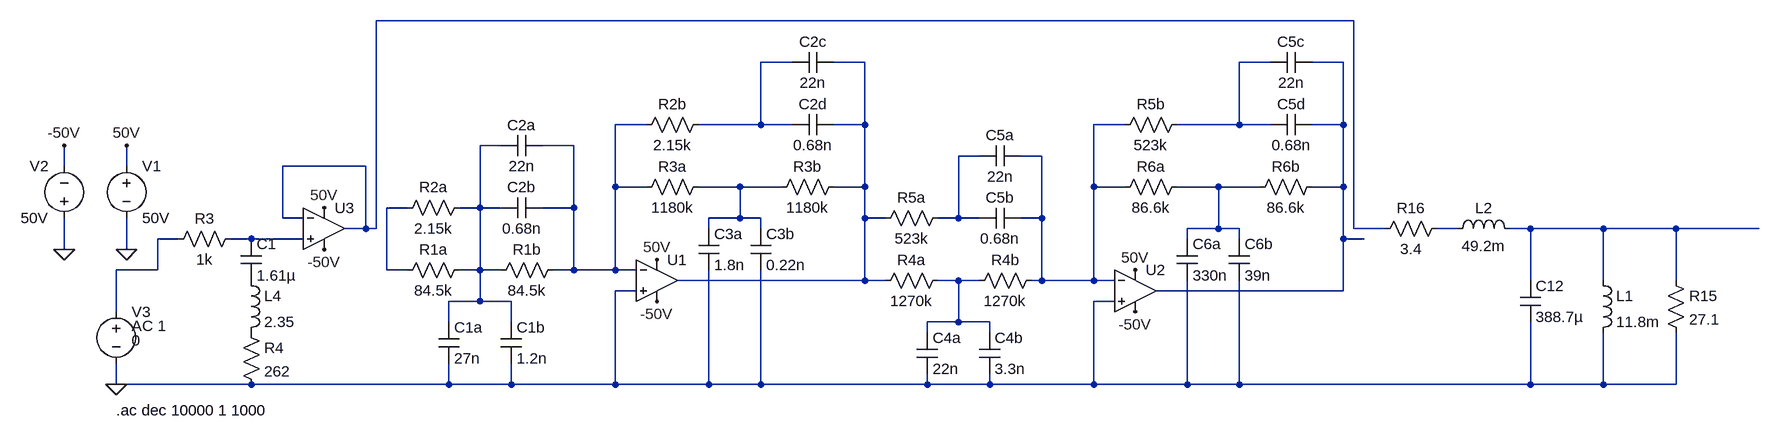
[diagram p0: schematic EXPERIMENT.asc]
EXPERIMENT.asc, the LTspice schematic file:
Version 4
SHEET 1 1284 1184
WIRE 480 160 -1024 160
WIRE -384 224 -432 224
WIRE -272 224 -320 224
WIRE 352 224 304 224
WIRE 464 224 416 224
WIRE -608 320 -656 320
WIRE -432 320 -432 224
WIRE -432 320 -528 320
WIRE -384 320 -432 320
WIRE -272 320 -272 224
WIRE -272 320 -320 320
WIRE 128 320 80 320
WIRE 304 320 304 224
WIRE 304 320 208 320
WIRE 352 320 304 320
WIRE 464 320 464 224
WIRE 464 320 416 320
WIRE -832 352 -864 352
WIRE -720 352 -768 352
WIRE -96 368 -128 368
WIRE 0 368 -32 368
WIRE -1504 384 -1504 352
WIRE -1408 384 -1408 352
WIRE -1040 384 -1168 384
WIRE -656 416 -656 320
WIRE -608 416 -656 416
WIRE -464 416 -528 416
WIRE -400 416 -464 416
WIRE -272 416 -272 320
WIRE -272 416 -320 416
WIRE 80 416 80 320
WIRE 128 416 80 416
WIRE 272 416 208 416
WIRE 336 416 272 416
WIRE 464 416 464 320
WIRE 464 416 416 416
WIRE -976 448 -1008 448
WIRE -864 448 -864 352
WIRE -864 448 -896 448
WIRE -832 448 -864 448
WIRE -720 448 -720 352
WIRE -720 448 -768 448
WIRE -1168 464 -1168 384
WIRE -1136 464 -1168 464
WIRE -464 464 -464 416
WIRE -464 464 -512 464
WIRE -432 464 -464 464
WIRE -272 464 -272 416
WIRE -240 464 -272 464
WIRE -128 464 -128 368
WIRE -128 464 -160 464
WIRE -96 464 -128 464
WIRE 0 464 0 368
WIRE 0 464 -32 464
WIRE -1040 480 -1040 384
WIRE -1040 480 -1072 480
WIRE -1024 480 -1024 160
WIRE -1024 480 -1040 480
WIRE -512 480 -512 464
WIRE -432 480 -432 464
WIRE 272 480 272 416
WIRE 272 480 224 480
WIRE 304 480 272 480
WIRE 480 480 480 160
WIRE 528 480 480 480
WIRE 640 480 608 480
WIRE 752 480 720 480
WIRE 864 480 752 480
WIRE 976 480 864 480
WIRE 1104 480 976 480
WIRE -1328 496 -1360 496
WIRE -1216 496 -1248 496
WIRE -1136 496 -1216 496
WIRE 224 496 224 480
WIRE 304 496 304 480
WIRE 464 496 464 416
WIRE 496 496 464 496
WIRE -1504 512 -1504 464
WIRE -1408 512 -1408 464
WIRE -1360 544 -1360 496
WIRE -1360 544 -1424 544
WIRE -1008 544 -1008 448
WIRE -976 544 -1008 544
WIRE -864 544 -864 448
WIRE -864 544 -896 544
WIRE -832 544 -864 544
WIRE -720 544 -720 448
WIRE -720 544 -752 544
WIRE -656 544 -656 416
WIRE -656 544 -720 544
WIRE -624 544 -656 544
WIRE -272 560 -272 464
WIRE -272 560 -560 560
WIRE -240 560 -272 560
WIRE -128 560 -160 560
WIRE -96 560 -128 560
WIRE 0 560 0 464
WIRE 0 560 -16 560
WIRE 80 560 80 416
WIRE 80 560 0 560
WIRE 112 560 80 560
WIRE 752 560 752 480
WIRE 864 560 864 480
WIRE 976 560 976 480
WIRE -624 576 -656 576
WIRE 464 576 464 496
WIRE 464 576 176 576
WIRE -864 592 -864 544
WIRE -864 592 -912 592
WIRE -816 592 -864 592
WIRE 112 592 80 592
WIRE -1424 608 -1424 544
WIRE -912 624 -912 592
WIRE -816 624 -816 592
WIRE -128 624 -128 560
WIRE -128 624 -176 624
WIRE -80 624 -128 624
WIRE -176 640 -176 624
WIRE -80 640 -80 624
WIRE -1424 720 -1424 688
WIRE -1216 720 -1424 720
WIRE -912 720 -912 688
WIRE -912 720 -1216 720
WIRE -816 720 -816 688
WIRE -816 720 -912 720
WIRE -656 720 -656 576
WIRE -656 720 -816 720
WIRE -512 720 -512 544
WIRE -512 720 -656 720
WIRE -432 720 -432 544
WIRE -432 720 -512 720
WIRE -176 720 -176 704
WIRE -176 720 -432 720
WIRE -80 720 -80 704
WIRE -80 720 -176 720
WIRE 80 720 80 592
WIRE 80 720 -80 720
WIRE 224 720 224 560
WIRE 224 720 80 720
WIRE 304 720 304 560
WIRE 304 720 224 720
WIRE 752 720 752 624
WIRE 752 720 304 720
WIRE 864 720 864 640
WIRE 864 720 752 720
WIRE 976 720 976 640
WIRE 976 720 864 720
FLAG -1424 720 0
FLAG -1408 352 50V
FLAG -1504 352 -50V
FLAG -1504 512 0
FLAG -1408 512 0
FLAG -592 528 50V
FLAG -592 592 -50V
FLAG 144 544 50V
FLAG 144 608 -50V
FLAG -1104 448 50V
FLAG -1104 512 -50V
SYMBOL res -880 528 R90
WINDOW 0 0 56 VBottom 2
WINDOW 3 32 56 VTop 2
SYMATTR InstName R1a
SYMATTR Value 84.5k
SYMBOL res -736 528 R90
WINDOW 0 0 56 VBottom 2
WINDOW 3 32 56 VTop 2
SYMATTR InstName R1b
SYMATTR Value 84.5k
SYMBOL res -880 432 R90
WINDOW 0 0 56 VBottom 2
WINDOW 3 32 56 VTop 2
SYMATTR InstName R2a
SYMATTR Value 2.15k
SYMBOL cap -768 432 R90
WINDOW 0 0 32 VBottom 2
WINDOW 3 32 32 VTop 2
SYMATTR InstName C2b
SYMATTR Value 0.68n
SYMBOL Opamps/UniversalOpamp2 -592 560 R0
SYMATTR InstName U1
SYMBOL cap -928 624 R0
SYMATTR InstName C1a
SYMATTR Value 27n
SYMBOL res -512 400 R90
WINDOW 0 0 56 VBottom 2
WINDOW 3 32 56 VTop 2
SYMATTR InstName R3a
SYMATTR Value 1180k
SYMBOL cap -528 480 R0
SYMATTR InstName C3a
SYMATTR Value 1.8n
SYMBOL res -304 400 R90
WINDOW 0 0 56 VBottom 2
WINDOW 3 32 56 VTop 2
SYMATTR InstName R3b
SYMATTR Value 1180k
SYMBOL res -512 304 R90
WINDOW 0 0 56 VBottom 2
WINDOW 3 32 56 VTop 2
SYMATTR InstName R2b
SYMATTR Value 2.15k
SYMBOL cap -320 304 R90
WINDOW 0 0 32 VBottom 2
WINDOW 3 32 32 VTop 2
SYMATTR InstName C2d
SYMATTR Value 0.68n
SYMBOL cap 736 560 R0
SYMATTR InstName C12
SYMATTR Value 388.7µ
SYMBOL ind 848 544 R0
SYMATTR InstName L1
SYMATTR Value 11.8m
SYMBOL res 960 544 R0
SYMATTR InstName R15
SYMATTR Value 27.1
SYMBOL res 624 464 R90
WINDOW 0 0 56 VBottom 2
WINDOW 3 32 56 VTop 2
SYMATTR InstName R16
SYMATTR Value 3.4
SYMBOL voltage -1424 592 R0
WINDOW 123 24 38 Left 2
WINDOW 39 0 0 Left 0
WINDOW 3 24 60 Left 2
SYMATTR Value2 AC 1
SYMATTR Value 0
SYMATTR InstName V3
SYMBOL voltage -1408 368 R0
SYMATTR InstName V1
SYMATTR Value 50V
SYMBOL voltage -1504 480 R180
WINDOW 0 24 96 Left 2
WINDOW 3 24 16 Left 2
SYMATTR InstName V2
SYMATTR Value 50V
SYMBOL cap -832 624 R0
SYMATTR InstName C1b
SYMATTR Value 1.2n
SYMBOL cap -768 336 R90
WINDOW 0 0 32 VBottom 2
WINDOW 3 32 32 VTop 2
SYMATTR InstName C2a
SYMATTR Value 22n
SYMBOL cap -320 208 R90
WINDOW 0 0 32 VBottom 2
WINDOW 3 32 32 VTop 2
SYMATTR InstName C2c
SYMATTR Value 22n
SYMBOL cap -448 480 R0
SYMATTR InstName C3b
SYMATTR Value 0.22n
SYMBOL ind 624 496 R270
WINDOW 0 32 56 VTop 2
WINDOW 3 5 56 VBottom 2
SYMATTR InstName L2
SYMATTR Value 49.2m
SYMBOL res -144 544 R90
WINDOW 0 0 56 VBottom 2
WINDOW 3 32 56 VTop 2
SYMATTR InstName R4a
SYMATTR Value 1270k
SYMBOL res 0 544 R90
WINDOW 0 0 56 VBottom 2
WINDOW 3 32 56 VTop 2
SYMATTR InstName R4b
SYMATTR Value 1270k
SYMBOL res -144 448 R90
WINDOW 0 0 56 VBottom 2
WINDOW 3 32 56 VTop 2
SYMATTR InstName R5a
SYMATTR Value 523k
SYMBOL cap -32 448 R90
WINDOW 0 0 32 VBottom 2
WINDOW 3 32 32 VTop 2
SYMATTR InstName C5b
SYMATTR Value 0.68n
SYMBOL Opamps/UniversalOpamp2 144 576 R0
SYMATTR InstName U2
SYMBOL cap -192 640 R0
SYMATTR InstName C4a
SYMATTR Value 22n
SYMBOL res 224 400 R90
WINDOW 0 0 56 VBottom 2
WINDOW 3 32 56 VTop 2
SYMATTR InstName R6a
SYMATTR Value 86.6k
SYMBOL cap 208 496 R0
SYMATTR InstName C6a
SYMATTR Value 330n
SYMBOL res 432 400 R90
WINDOW 0 0 56 VBottom 2
WINDOW 3 32 56 VTop 2
SYMATTR InstName R6b
SYMATTR Value 86.6k
SYMBOL res 224 304 R90
WINDOW 0 0 56 VBottom 2
WINDOW 3 32 56 VTop 2
SYMATTR InstName R5b
SYMATTR Value 523k
SYMBOL cap 416 304 R90
WINDOW 0 0 32 VBottom 2
WINDOW 3 32 32 VTop 2
SYMATTR InstName C5d
SYMATTR Value 0.68n
SYMBOL cap -96 640 R0
SYMATTR InstName C4b
SYMATTR Value 3.3n
SYMBOL cap -32 352 R90
WINDOW 0 0 32 VBottom 2
WINDOW 3 32 32 VTop 2
SYMATTR InstName C5a
SYMATTR Value 22n
SYMBOL cap 416 208 R90
WINDOW 0 0 32 VBottom 2
WINDOW 3 32 32 VTop 2
SYMATTR InstName C5c
SYMATTR Value 22n
SYMBOL cap 288 496 R0
SYMATTR InstName C6b
SYMATTR Value 39n
SYMBOL res -1232 480 R90
WINDOW 0 0 56 VBottom 2
WINDOW 3 32 56 VTop 2
SYMATTR InstName R3
SYMATTR Value 1k
SYMBOL cap -1232 496 R0
SYMATTR InstName C1
SYMATTR Value 1.61µ
SYMBOL ind -1232 544 R0
SYMATTR InstName L4
SYMATTR Value 2.35
SYMBOL res -1232 624 R0
SYMATTR InstName R4
SYMATTR Value 262
SYMBOL Opamps/UniversalOpamp2 -1104 480 R0
SYMATTR InstName U3
TEXT -1424 760 Left 2 !.ac dec 10000 1 1000

The netlist it stands for:
* EXPERIMENT.asc
R1a N008 N012 84.5k
R1b N006 N008 84.5k
R2a N008 N012 2.15k
C2b N006 N008 0.68n
XU1 0 N006 50V -50V N003 level.2 Avol=1Meg GBW=10Meg Slew=10Meg ilimit=25m rail=0 Vos=0 phimargin=45 en=0 enk=0 in=0 ink=0 Rin=500Meg  ; pins IN+ IN- V+ V- OUT
C1a N008 0 27n
R3a N010 N006 1180k
C3a N010 0 1.8n
R3b N003 N010 1180k
R2b N002 N006 2.15k
C2d N003 N002 0.68n
C12 N014 0 388.7µ
L1 N014 0 11.8m
R15 N014 0 27.1
R16 N013 N001 3.4
V3 N015 0 0 AC 1
V1 50V 0 50V
V2 0 -50V 50V
C1b N008 0 1.2n
C2a N006 N008 22n
C2c N003 N002 22n
C3b N010 0 0.22n
L2 N013 N014 49.2m
R4a N017 N003 1270k
R4b N007 N017 1270k
R5a N009 N003 523k
C5b N007 N009 0.68n
XU2 0 N007 50V -50V N005 level.2 Avol=1Meg GBW=10Meg Slew=10Meg ilimit=25m rail=0 Vos=0 phimargin=45 en=0 enk=0 in=0 ink=0 Rin=500Meg  ; pins IN+ IN- V+ V- OUT
C4a N017 0 22n
R6a N011 N007 86.6k
C6a N011 0 330n
R6b N005 N011 86.6k
R5b N004 N007 523k
C5d N005 N004 0.68n
C4b N017 0 3.3n
C5a N007 N009 22n
C5c N005 N004 22n
C6b N011 0 39n
R3 N016 N015 1k
C1 N016 P001 1.61µ
L4 P001 P002 2.35
R4 P002 0 262
XU3 N016 N001 50V -50V N001 level.2 Avol=1Meg GBW=10Meg Slew=10Meg ilimit=25m rail=0 Vos=0 phimargin=45 en=0 enk=0 in=0 ink=0 Rin=500Meg  ; pins IN+ IN- V+ V- OUT
.ac dec 10000 1 1000
.lib UniversalOpamps2.sub
.backanno
.end